# Altium schematic sheet Pg3 Current Sensor.SchDoc: LEM Current Sensor Integration
size Letter; Engineer: Jon Larr; Organization: EV Kartz; Address1: Kettering University; Address2: 1700 University Ave; Address3: Flint, MI; Address4: United States of America; SheetNumber: 2; SheetTotal: 4
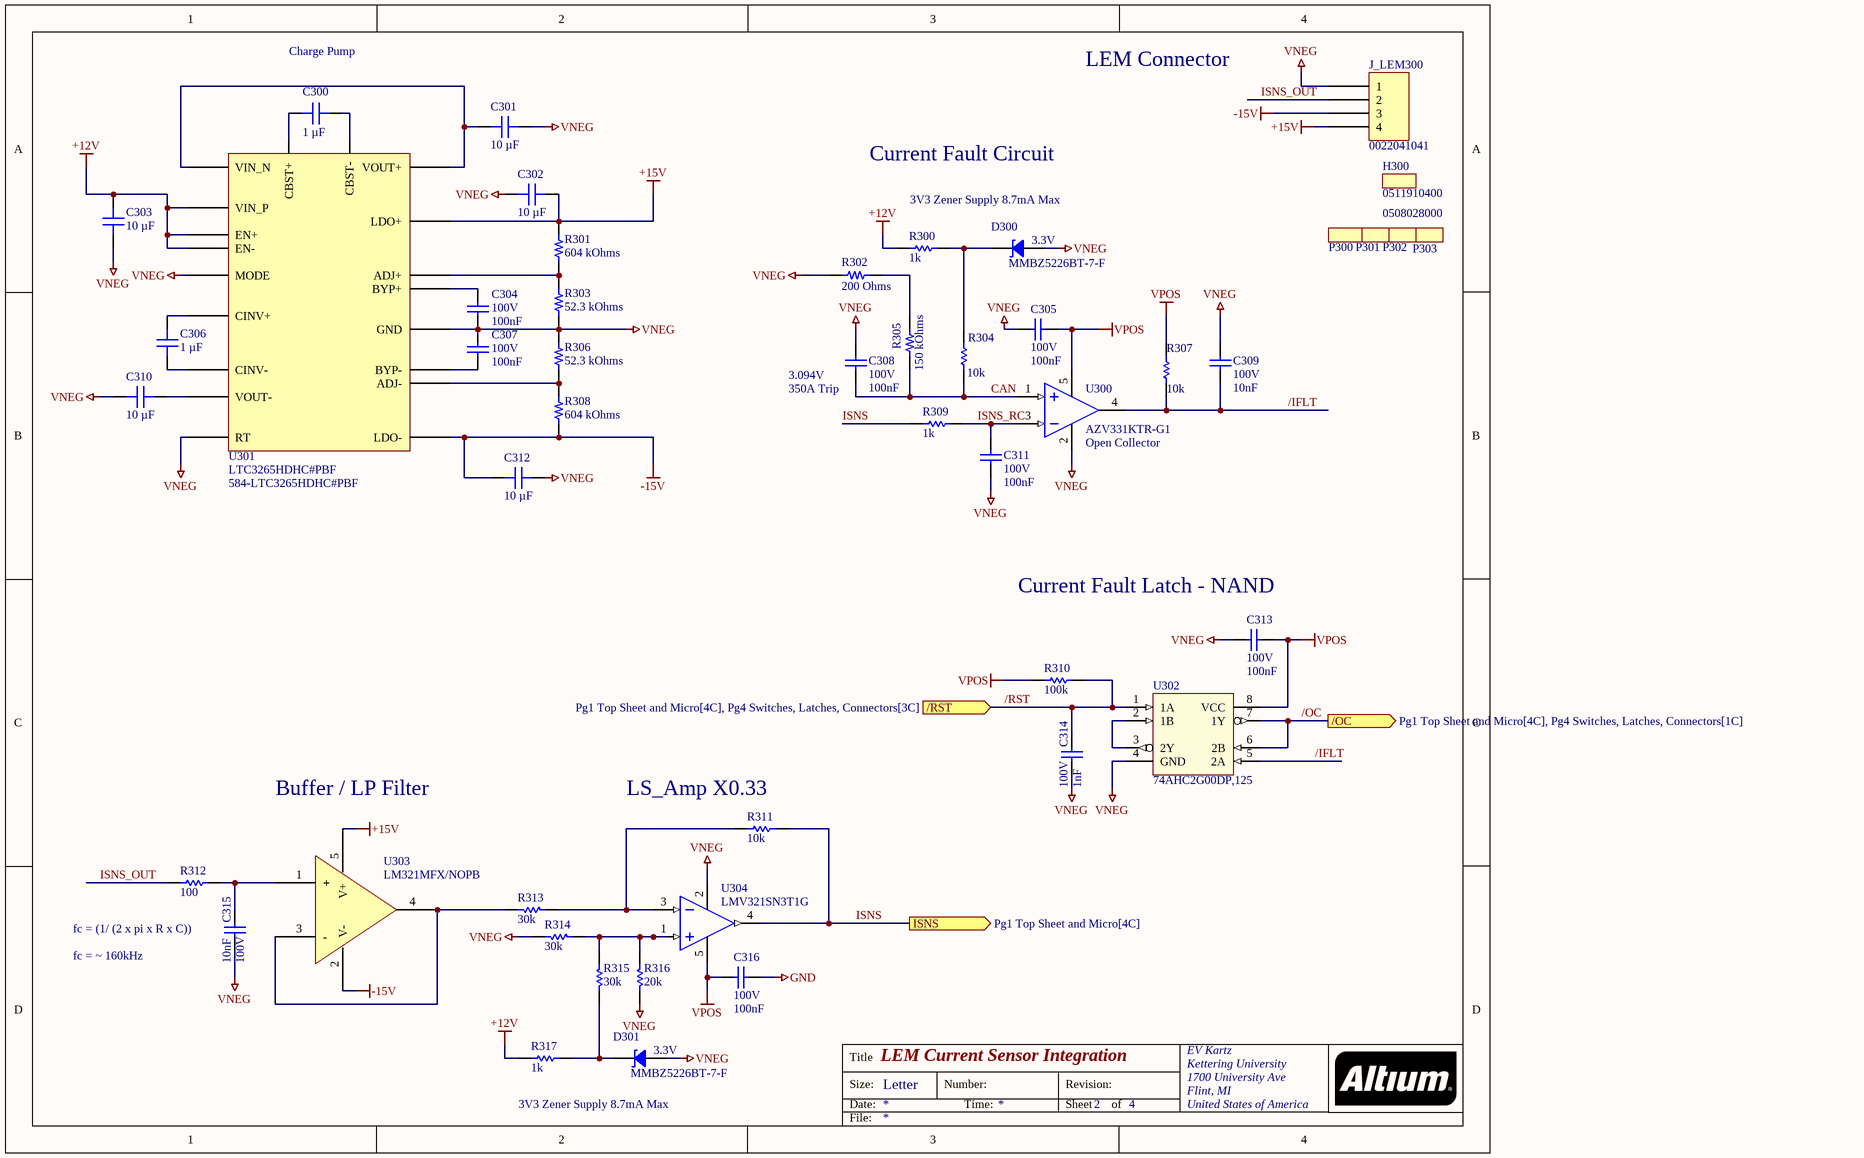
[diagram p0: Pg3 Current Sensor.SchDoc]

## Parts
C300  1 µF  [CAP 0805_2012]
C301  10 µF  [CAP 1206_3216 - 0.8MM]
C302  10 µF  [CAP 1206_3216 - 0.8MM]
C303  10 µF  [CAP 1206_3216 - 0.8MM]
C304  value 100nF  Rated: 100V  [CAPC2012N]  (hidden comment: C0805C104K1RACAUTO)
C305  value 100nF  Rated: 100V  [CAPC2012N]  (hidden comment: CL21B104KACNNNC)
C306  1 µF  [CAP 0805_2012]
C307  value 100nF  Rated: 100V  [CAPC2012N]  (hidden comment: C0805C104K1RACAUTO)
C308  value 100nF  Rated: 100V  [CAPC2012N]  (hidden comment: CL21B104KACNNNC)
C309  value 10nF  Rated: 100V  [CAPC2012N]  (hidden comment: C0805C103K1RAC7025)
C310  10 µF  [CAP 1206_3216 - 0.8MM]
C311  value 100nF  Rated: 100V  [CAPC2012N]  (hidden comment: CL21B104KACNNNC)
C312  10 µF  [CAP 1206_3216 - 0.8MM]
C313  value 100nF  Rated: 100V  [CAPC2012N]  (hidden comment: CL21B104KACNNNC)
C314  value 1nF  Rated: 100V  [CAPC2012N]  (hidden comment: C0805C102K1RACAUTO)
C315  value 10nF  Rated: 100V  [CAPC2012N]  (hidden comment: C0805C103K1RAC7025)
C316  value 100nF  Rated: 100V  [CAPC2012N]  (hidden comment: C0805C104K1RACAUTO)
D300  MMBZ5226BT-7-F  [DIODES SOT-523]
D301  MMBZ5226BT-7-F  [DIODES SOT-523]
H300  0511910400  (mechanical)
J_LEM300  0022041041  [0022041041]
P300  0508028000  (value not drawn)  (mechanical)
P301  0508028000  (value not drawn)  (mechanical)
P302  0508028000  (value not drawn)  (mechanical)
P303  0508028000  (mechanical)
R300  value 1k  [RESC2012N]  (hidden comment: ERJ-6ENF1001V)
R301  604 kOhms  [RES 0805_2012]
R302  200 Ohms  [RES 0805_2012]
R303  52.3 kOhms  [RES 0805_2012]
R304  value 10k  [RESC2012N]  (hidden comment: ERJ-6ENF1002V)
R305  150 kOhms  [RES 0805_2012]
R306  52.3 kOhms  [RES 0805_2012]
R307  value 10k  [RESC2012N]  (hidden comment: ERJ-6ENF1002V)
R308  604 kOhms  [RES 0805_2012]
R309  value 1k  [RESC2012N]  (hidden comment: ERJ-6ENF1001V)
R310  value 100k  [RESC2012N]  (hidden comment: ERJ-6ENF1003V)
R311  value 10k  [RESC2012N]  (hidden comment: ERJ-6ENF1002V)
R312  value 100  [RESC2012N]  (hidden comment: ERJ-6ENF1000V)
R313  value 30k  [RESC2012N]  (hidden comment: ERJ-6ENF3002V)
R314  value 30k  [RESC2012N]  (hidden comment: ERJ-6ENF3002V)
R315  value 30k  [RESC2012N]  (hidden comment: ERJ-6ENF3002V)
R316  value 20k  [RESC2012N]  (hidden comment: ERJ-6ENF2002V)
R317  value 1k  [RESC2012N]  (hidden comment: ERJ-6ENF1001V)
U300  AZV331KTR-G1  [SOT23-5N]
U301  LTC3265HDHC#PBF  Supplier Part Number 1: 584-LTC3265HDHC#PBF  [DHC]
U302  74AHC2G00DP,125  [TSSOP-8]
U303  LM321MFX/NOPB  [TI SOT-23-5 DBV]
U304  LMV321SN3T1G  [SOT23-5N]

## Ports
/OC (out, see Pg1 Top Sheet and Micro[4C], Pg4 Switches, Latches, Connectors[1C]), /RST (in, see Pg1 Top Sheet and Micro[4C], Pg4 Switches, Latches, Connectors[3C]), ISNS (out, see Pg1 Top Sheet and Micro[4C])

## Nets
+12V: C303.1 R300.1 R317.1 U301.3(VIN_P) U301.4(EN-) U301.13(EN+)
+15V: C302.2 J_LEM300.4 R301.2 U301.17(LDO+) U303.5(V+)
-15V: C312.2 J_LEM300.3 R308.1 U301.7(LDO-) U303.2(V-)
GND: C316.2
VNEG: C301.2 C302.1 C303.2 C304.2 C305.2 C307.1 C308.1 C309.1 C310.2 C311.2 C312.1 C313.2 C314.2 C315.2 D300.1 D301.1 J_LEM300.1 R302.1 R303.1 R306.2 R314.2 R316.1 U300.2(VEE) U301.12(RT) U301.14(MODE) U301.19(GND) U302.4(GND) U304.2(V-)
VPOS: C305.1 C313.1 C316.1 R307.1 R310.2 U300.5(VCC) U302.8(VCC) U304.5(V+)
/IFLT: C309.2 R307.2 U300.4(OUT) U302.5(2A)
/OC: U302.6(2B) U302.7(1Y) ; port /OC
/RST: C314.1 R310.1 U302.1(1A) ; port /RST
CAN: C308.2 R304.2 R305.1 U300.1(IN+)
ISNS: R309.1 R311.1 U304.4(OUT) ; port ISNS
ISNS_OUT: J_LEM300.2 R312.1
ISNS_RC: C311.1 R309.2 U300.3(IN-)
NetC300_1: C300.1 U301.2(CBST+)
NetC300_2: C300.2 U301.1(CBST-)
NetC301_1: C301.1 U301.11(VIN_N) U301.18(VOUT+)
NetC304_1: C304.1 U301.15(BYP+)
NetC306_1: C306.1 U301.9(CINV-)
NetC306_2: C306.2 U301.10(CINV+)
NetC307_2: C307.2 U301.5(BYP-)
NetC310_1: C310.1 U301.8(VOUT-)
NetC315_1: C315.1 R312.2 U303.1(+)
NetD300_2: D300.2 R300.2 R304.1
NetD301_2: D301.2 R315.1 R317.2
NetR301_1: R301.1 R303.2 U301.16(ADJ+)
NetR302_2: R302.2 R305.2
NetR306_1: R306.1 R308.2 U301.6(ADJ-)
NetR311_2: R311.2 R313.1 U304.3(IN-)
NetR313_2: R313.2 U303.3(-) U303.4(OUT)
NetR314_1: R314.1 R315.2 R316.2 U304.1(IN+)
NetU302_2: U302.2(1B) U302.3(2Y)

## Notes on the sheet
- Charge Pump
- LEM Connector
- Current Fault Circuit
- 3V3 Zener Supply 8.7mA Max
- (near D300) 3.3V
- (near C308) 3.094V
- (near C308) 350A Trip
- (near U300) Open Collector
- (near C313) Current Fault Latch - NAND
- Buffer / LP Filter
- (near R311) LS_Amp X0.33
- (near C315) fc = (1/ (2 x pi x R x C))
- fc = ~ 160kHz
- (near D301) 3.3V
- Title
- Size:
- Date:
- Letter
- Number:
- Time:
- Revision:
- Sheet
- of
- File:

## Library data of the parts
C300 C306 = GRM21BC72A105KE01L: CAP CER 1UF 100V X7S 0805; manufacturer: Murata Electronics; Tolerance: ±10%; Part Number: GRM21BC72A105KE01L; Value: 1 µF; Applications: General Purpose; Capacitance: 1 µF; componentlink1description: Datasheet; componentlink1url: https://search.murata.co.jp/Ceramy/image/img/A01X/G101/ENG/GRM21BC72A105KE01-01.pdf; componentlink2description: DigiKey Link; componentlink2url: https://www.digikey.com/en/products/detail/murata-electronics/GRM21BC72A105KE01L/6606093; Device Package: 0805 (2012 Metric); lastupdated: 1/31/2023 8:11:09 PM; Lifecycle Status: Active; Minimum Order: 1; Mounting Type: Surface Mount, MLCC; Operating Temperature: -55°C ~ 125°C; Package / Case: 0805 (2012 Metric); packaging: TapeAndReel; partid: 8550; Part Status: Active; price: 0.07; series: GRM; Size / Dimension: 0.079" L x 0.049" W (2.00mm x 1.25mm); Supplier 1: DigiKey; Supplier Part Number 1: 490-14464-1-ND; Temperature Coefficient: X7S; Thickness (Max): 0.057" (1.45mm); Voltage - Rated: 100V
C301-C303 C310 C312 = 1206X106K250CT: CAP CER 10UF 25V X5R 1206; manufacturer: Walsin Technology Corporation; Tolerance: ±10%; Part Number: 1206X106K250CT; Value: 10 µF; Applications: General Purpose; Capacitance: 10 µF; componentlink1description: Datasheet; componentlink1url: https://www.passivecomponent.com/wp-content/uploads/datasheet/WTC_MLCC_General_Purpose.pdf; componentlink2description: DigiKey Link; componentlink2url: https://www.digikey.com/en/products/detail/walsin-technology-corporation/1206X106K250CT/14836856; Device Package: 1206 (3216 Metric); lastupdated: 1/31/2023 8:12:49 PM; Lifecycle Status: Active; Minimum Order: 1; Mounting Type: Surface Mount, MLCC; Operating Temperature: -55°C ~ 85°C; Package / Case: 1206 (3216 Metric); packaging: TapeAndReel; partid: 45632; Part Status: Active; price: 0.10; series: -; Size / Dimension: 0.126" L x 0.063" W (3.20mm x 1.60mm); Supplier 1: DigiKey; Supplier Part Number 1: 1292-1206X106K250CT-ND; Temperature Coefficient: X5R; Thickness (Max): 0.075" (1.90mm); Voltage - Rated: 25V
C304 C307 C316 = C0805C104K1RACAUTO: Capacitor, Ceramic, 100nF, 100V, 0805, 10%, 125C; Supplier 1: Digi-Key; Supplier Part Number 1: 399-6926-1-ND; Category: C; Tol: 10%; Temp: 125C
C305 C308 C311 C313 = C0805C104K1RACAUTO: Capacitor, Ceramic, 100nF, 25V, 0805, 10%, 125C; Category: C; Tol: 10%; Temp: 125C; Supplier 1: Digi-Key; Supplier Part Number 1: 1276-1099-1-ND
C309 C315 = C0805C103K1RAC7025: Capacitor, Ceramic, 10nF, 100V, 0805, 10%, 125C; Supplier 1: Digi-Key; Supplier Part Number 1: 399-C0805C103K1RAC7025CT-ND; Category: C; Tol: 10%; Temp: 125C
C314 = C0805C102K1RACAUTO: Capacitor, Ceramic, 1nF, 100V, 0805, 10%, 125C; Supplier 1: Digi-Key; Supplier Part Number 1: 399-6919-1-ND; Category: C; Tol: 10%; Temp: 125C
D300 D301 = MMBZ5226BT-7-F: DIODE ZENER 3.3V 150MW SOT523; Manufacturer: Diodes Incorporated; Current - Reverse Leakage @ Vr: 25 µA @ 1 V; Impedance (Max) (Zzt): 28 Ohms; Tolerance: ±5%; Voltage - Forward (Vf) (Max) @ If: 900 mV @ 10 mA; Part Number: MMBZ5226BT-7-F; ComponentLink1Description: Datasheet; ComponentLink1URL: https://www.diodes.com/assets/Datasheets/ds30267.pdf; ComponentLink2Description: DigiKey Link; ComponentLink2URL: https://www.digikey.com/en/products/detail/diodes-incorporated/MMBZ5226BT-7-F/2095654; LastUpdated: 1/31/2023 8:49:11 PM; Lifecycle Status: Active; Minimum Order: 1; Mounting Type: Surface Mount; Operating Temperature: -65°C ~ 150°C; Package / Case: SOT-523; Packaging: TapeAndReel; PartId: 790; Part Status: Active; Power - Max: 150 mW; Price: 0.05; Series: -; Supplier 1: DigiKey; Supplier Part Number 1: MMBZ5226BTDICT-ND; Supplier Device Package: SOT-523; Voltage - Zener (Nom) (Vz): 3.3 V
H300 = 0022041041(Housing): Housing, Molex, Maiting Part 0511910400; Value: 4 Pos; Category: J; Supplier 1: Digi-Key; Supplier Part Number 1: WM3350-ND
J_LEM300 = 0022041041: Header, 4 pos, 2.5mm pitch, Molex / Kit Parts / Housing: 0511910400 / Terminals: 0508028000; Value: 4 Pos; Temp: 80C; Rated: N/A; Category: J; Tol: N/A; Supplier 1: Digi-Key; Supplier Part Number 1: WM18787-ND
P300-P303 = 0022041041(Terminal): Terminal, Molex, Maiting Part 0511910400; Value: 4 Pos; Category: J; Supplier 1: Digi-Key; Supplier Part Number 1: WM3328CT-ND
R300 R309 R317 = ERJ-6ENF1001V: Resistor, Fixed, 1 kOhm, 0805, 1%, 1/8W; Supplier 1: Digi-Key; Supplier Part Number 1: P1.00KCCT-ND; Rated: 1/8W; Tol: 1%; Category: R
R301 R308 = RMCF0805FT604K: RES 604K OHM 1% 1/8W 0805; Manufacturer: Stackpole Electronics Inc; Power (Watts): 0.125W, 1/8W; Temperature Coefficient: ±100ppm/°C; Part Number: RMCF0805FT604K; Value: 604 kOhms; ComponentLink1Description: Datasheet; ComponentLink1URL: https://www.seielect.com/catalog/sei-rmcf_rmcp.pdf; ComponentLink2Description: DigiKey Link; ComponentLink2URL: https://www.digikey.com/en/products/detail/stackpole-electronics-inc/RMCF0805FT604K/1760364; Composition: Thick Film; Device Package: 0805 (2012 Metric); Features: Automotive AEC-Q200; Height - Seated (Max): 0.026" (0.65mm); LastUpdated: 1/2/2023 8:44:07 PM; Lifecycle Status: Active; Minimum Order: 1; Number of Terminations: 2; Operating Temperature: -55°C ~ 155°C; Package / Case: 0805 (2012 Metric); Packaging: CutTape; PartId: 38394; Part Status: Active; Price: 0.01; Ratings: AEC-Q200; Resistance: 604 kOhms; Series: RMCF; Size / Dimension: 0.079" L x 0.049" W (2.00mm x 1.25mm); Supplier 1: DigiKey; Supplier Part Number 1: 738-RMCF0805FT604KCT-ND; Supplier Device Package: 0805; Tolerance: ±1%
R302 = ERA-6AED201V: RES 200 OHM 0.5% 1/8W 0805; Manufacturer: Panasonic Electronic Components; Power (Watts): 0.125W, 1/8W; Temperature Coefficient: ±25ppm/°C; Part Number: ERA-6AED201V; Value: 200 Ohms; ComponentLink1Description: Datasheet; ComponentLink1URL: https://industrial.panasonic.com/cdbs/www-data/pdf/RDM0000/AOA0000C307.pdf; ComponentLink2Description: DigiKey Link; ComponentLink2URL: https://www.digikey.com/en/products/detail/panasonic-electronic-components/ERA-6AED201V/9373598; Composition: Thin Film; Device Package: 0805 (2012 Metric); Features: Automotive AEC-Q200; Height - Seated (Max): 0.024" (0.60mm); LastUpdated: 1/2/2023 8:43:38 PM; Lifecycle Status: Active; Minimum Order: 1; Number of Terminations: 2; Operating Temperature: -55°C ~ 155°C; Package / Case: 0805 (2012 Metric); Packaging: TapeAndReel; PartId: 45624; Part Status: Active; Price: 0.05; Ratings: AEC-Q200; Resistance: 200 Ohms; Series: ERA-6A; Size / Dimension: 0.079" L x 0.049" W (2.00mm x 1.25mm); Supplier 1: DigiKey; Supplier Part Number 1: P123819CT-ND; Supplier Device Package: 0805; Tolerance: ±0.5%
R303 R306 = RMCF0805FT52K3: RES 52.3K OHM 1% 1/8W 0805; Manufacturer: Stackpole Electronics Inc; Power (Watts): 0.125W, 1/8W; Temperature Coefficient: ±100ppm/°C; Part Number: RMCF0805FT52K3; Value: 52.3 kOhms; ComponentLink1Description: Datasheet; ComponentLink1URL: https://www.seielect.com/catalog/sei-rmcf_rmcp.pdf; ComponentLink2Description: DigiKey Link; ComponentLink2URL: https://www.digikey.com/en/products/detail/stackpole-electronics-inc/RMCF0805FT52K3/1760139; Composition: Thick Film; Device Package: 0805 (2012 Metric); Features: Automotive AEC-Q200; Height - Seated (Max): 0.026" (0.65mm); LastUpdated: 1/2/2023 8:44:08 PM; Lifecycle Status: Active; Minimum Order: 1; Number of Terminations: 2; Operating Temperature: -55°C ~ 155°C; Package / Case: 0805 (2012 Metric); Packaging: CutTape; PartId: 38093; Part Status: Active; Price: 0.01; Ratings: AEC-Q200; Resistance: 52.3 kOhms; Series: RMCF; Size / Dimension: 0.079" L x 0.049" W (2.00mm x 1.25mm); Supplier 1: DigiKey; Supplier Part Number 1: RMCF0805FT52K3CT-ND; Supplier Device Package: 0805; Tolerance: ±1%
R304 R307 R311 = ERJ-6ENF1002V: Resistor, Fixed, 10 kOhm, 0805, 1%, 1/8W; Supplier 1: Digi-Key; Supplier Part Number 1: P10.0KCCT-ND; Rated: 1/8W; Tol: 1%; Category: R
R305 = ERA-6AEB154V: RES 150K OHM 0.1% 1/8W 0805; Manufacturer: Panasonic Electronic Components; Power (Watts): 0.125W, 1/8W; Temperature Coefficient: ±25ppm/°C; Part Number: ERA-6AEB154V; Value: 150 kOhms; ComponentLink1Description: Datasheet; ComponentLink1URL: https://industrial.panasonic.com/cdbs/www-data/pdf/RDM0000/AOA0000C307.pdf; ComponentLink2Description: DigiKey Link; ComponentLink2URL: https://www.digikey.com/en/products/detail/panasonic-electronic-components/ERA-6AEB154V/1465801; Composition: Thin Film; Device Package: 0805 (2012 Metric); Features: Automotive AEC-Q200; Height - Seated (Max): 0.024" (0.60mm); LastUpdated: 1/2/2023 8:43:14 PM; Lifecycle Status: Active; Minimum Order: 1; Number of Terminations: 2; Operating Temperature: -55°C ~ 155°C; Package / Case: 0805 (2012 Metric); Packaging: TapeAndReel; PartId: 48804; Part Status: Active; Price: 0.04; Ratings: AEC-Q200; Resistance: 150 kOhms; Series: ERA-6A; Size / Dimension: 0.079" L x 0.049" W (2.00mm x 1.25mm); Supplier 1: DigiKey; Supplier Part Number 1: P150KDACT-ND; Supplier Device Package: 0805; Tolerance: ±0.1%
R310 = ERJ-6ENF1003V: Resistor, Fixed, 100 kOhm, 0805, 1%, 1/8W; Supplier 1: Digi-Key; Supplier Part Number 1: P100KCCT-ND; Rated: 1/8W; Tol: 1%; Category: R
R312 = ERJ-6ENF1000V: Resistor, Fixed, 100 Ohm, 0805, 1%, 1/8W; Supplier 1: Digi-Key; Supplier Part Number 1: P100CCT-ND; Category: R; Rated: 1/8W; Tol: 1%
R313-R315 = ERJ-6ENF2002V: Resistor, Fixed, 30 kOhm, 0805, 1%, 1/8W; Rated: 1/8W; Tol: 1%; Category: R; Supplier 1: Digi-Key; Supplier Part Number 1: P30.0KCCT-ND
R316 = ERJ-6ENF2002V: Resistor, Fixed, 20 kOhm, 0805, 1%, 1/8W; Rated: 1/8W; Tol: 1%; Supplier 1: Digi-Key; Supplier Part Number 1: P20.0KCCT-ND; Category: R
U300 = AZV331: Comparator, Single, Open-Drain, 84mA, 2.2V~5.5V; Rated: 2.2V~5.5V; Supplier 1: Digi-Key; Supplier Part Number 1: AZV331KTR-G1DICT-ND; Category: U
U301 = LTC3265HDHC: Supply, Bipolar Charge Pump, +/-15V; Supplier 1: Mouser
U302 = 74AHC2G00: Logic, NAND, Dual, Schmitt Trigger, TSSOP-8; Rated: 5.5V, 24mA; Category: U; Supplier 1: Digi-Key; Supplier Part Number 1: 1727-6521-1-ND
U303 = LM321MFX/NOPB: IC OPAMP GP 1 CIRCUIT SOT23-5; Manufacturer: Texas Instruments; Amplifier Type: General Purpose; Current - Input Bias: 45nA; Current - Output / Channel: 40mA; Current - Supply: 660µA; Gain Bandwidth Product: 1MHz; Number of Circuits: 1; Slew Rate: 0.4V/µs; Voltage - Input Offset: 2mV; Voltage - Supply, Single/Dual (±): 3V ~ 30V, ±1.5V ~ 15V; Part Number: LM321MFX/NOPB; ComponentLink1Description: Datasheet; ComponentLink1URL: http://www.ti.com/general/docs/suppproductinfo.tsp?distId=10&gotoUrl=http%3A%2F%2Fwww.ti.com%2Flit%2Fgpn%2Flm321; ComponentLink2Description: DigiKey Link; ComponentLink2URL: http://digikey.com/product-detail/en/texas-instruments/LM321MFX-NOPB/LM321MFX-NOPBCT-ND/3440175; Device Package: SC-74A, SOT-753; LastUpdated: 3/30/2020 3:10:59 PM; Lifecycle Status: Active; Minimum Order: 1; Mounting Type: Surface Mount; Operating Temperature: -40°C ~ 85°C; Package / Case: SC-74A, SOT-753; Packaging: TapeAndReel; PartId: 11; Part Status: Active; Price: 0.23; Series: -; Supplier 1: DigiKey; Supplier Part Number 1: LM321MFX/NOPBCT-ND; Supplier Device Package: SOT-23-5
U304 = LMV321: Op-Amp, Single, 1MHz, 1V/us, R2R, 2.7V~5.5V, 160mA; Rated: 2.7V~5.5V, 160mA; Supplier 1: Digi-Key; Supplier Part Number 1: LMV321SN3T1GOSCT-ND; Category: U